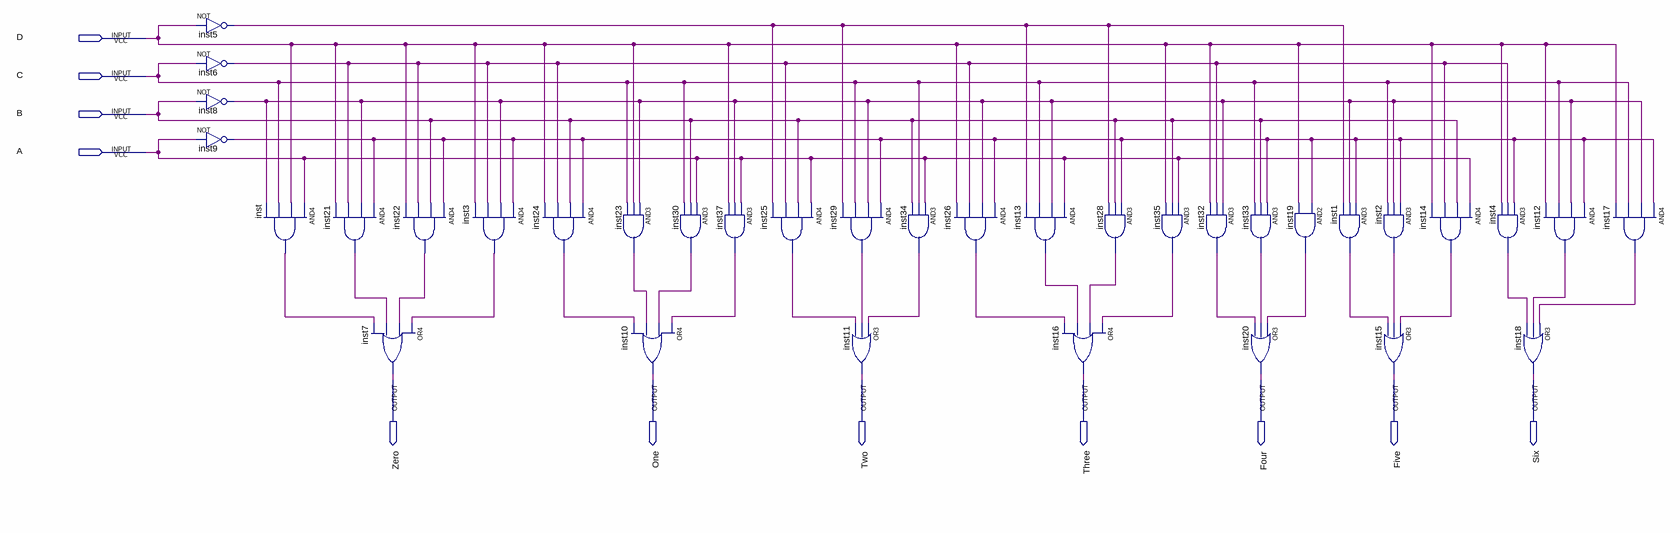
[diagram p0: schematic sheet]
// Quartus schematic secondsevenseg.bdf as structural Verilog: 35 symbols, 11 pins
module secondsevenseg (
  input  D,
  input  C,
  input  B,
  input  A,
  output Zero,
  output One,
  output Two,
  output Three,
  output Four,
  output Five,
  output Six
);

  wire inst1_out, inst2_out, inst3_out, inst4_out, inst5_out, inst6_out, inst8_out, inst9_out, inst12_out,
       inst13_out, inst14_out, inst17_out, inst19_out, inst21_out, inst22_out, inst23_out, inst24_out,
       inst25_out, inst26_out, inst28_out, inst29_out, inst30_out, inst32_out, inst33_out, inst34_out,
       inst35_out, inst37_out, inst_out;

  not inst5 (inst5_out, D);
  not inst6 (inst6_out, C);
  not inst8 (inst8_out, B);
  not inst9 (inst9_out, A);
  and inst (inst_out, A, D, C, inst8_out);
  and inst21 (inst21_out, inst9_out, inst8_out, inst6_out, D);
  and inst22 (inst22_out, inst9_out, B, inst6_out, D);
  or inst7 (Zero, inst3_out, inst22_out, inst21_out, inst_out);
  and inst3 (inst3_out, inst9_out, inst8_out, inst6_out, D);
  and inst24 (inst24_out, inst9_out, B, inst6_out, D);
  and inst23 (inst23_out, inst8_out, D, C);
  or inst10 (One, inst37_out, inst30_out, inst23_out, inst24_out);
  and inst30 (inst30_out, A, B, C);
  and inst25 (inst25_out, A, B, inst6_out, inst5_out);
  and inst37 (inst37_out, A, inst8_out, D);
  and inst29 (inst29_out, inst9_out, inst8_out, C, inst5_out);
  or inst11 (Two, inst34_out, inst29_out, inst25_out);
  and inst34 (inst34_out, A, C, B);
  and inst26 (inst26_out, inst9_out, inst8_out, inst6_out, D);
  and inst13 (inst13_out, A, inst8_out, C, inst5_out);
  or inst16 (Three, inst35_out, inst28_out, inst13_out, inst26_out);
  and inst28 (inst28_out, inst9_out, B, inst5_out);
  and inst35 (inst35_out, A, B, D);
  and inst32 (inst32_out, inst8_out, inst6_out, D);
  and inst33 (inst33_out, inst9_out, B, C);
  or inst20 (Four, inst19_out, inst33_out, inst32_out);
  and inst19 (inst19_out, inst9_out, D);
  and inst1 (inst1_out, inst9_out, inst8_out, inst5_out);
  and inst14 (inst14_out, A, B, inst6_out, D);
  and inst2 (inst2_out, inst9_out, inst8_out, C);
  or inst15 (Five, inst14_out, inst2_out, inst1_out);
  and inst4 (inst4_out, inst9_out, inst6_out, D);
  or inst18 (Six, inst17_out, inst12_out, inst4_out);
  and inst12 (inst12_out, inst9_out, inst8_out, C, D);
  and inst17 (inst17_out, inst9_out, inst8_out, C, D);
endmodule
